# EAGLE schematic untitled (EAGLE 8.6.0)
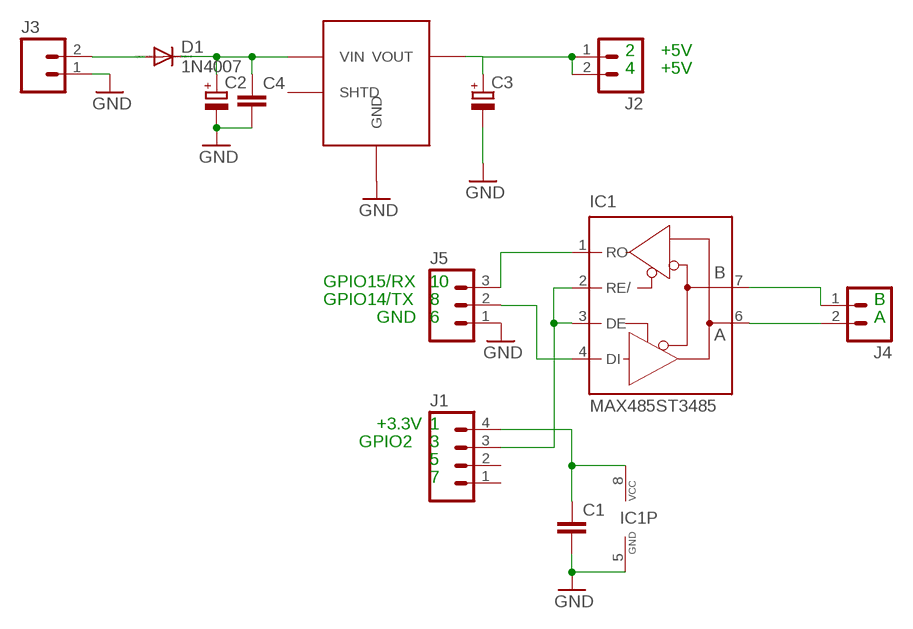
[diagram p0: schematic, sheet 1]

## Parts
C1  C-EU050-025X075  [C050-025X075]
C2  CPOL-EUSMD4X5.3  [UD-4X5,8_NICHICON]
C3  CPOL-EUSMD4X5.3  [UD-4X5,8_NICHICON]
C4  C-EU050-025X075  [C050-025X075]
D1  1N4007  [DO41-10]
IC1  MAX485ST3485  [SO08]
J1  M04  [1X04]
J2  M02  [1X02]
J3  M02-SCREW-3.5MM3.5MM  [SCREWTERMINAL-3.5MM-2]
J4  M02-SCREW-3.5MM3.5MM  [SCREWTERMINAL-3.5MM-2]
J5  M03  [1X03]
U$1  POLOLU-2098  [POLOLU-10-13]

## Nets
GND: C1.2 C2.- C3.- C4.2 IC1.5(GND) J3.1 J5.1 U$1.P$3(GND)
N$1: D1.A J3.2
N$2: C2.+ C4.1 D1.C U$1.P$2(VIN)
N$3: IC1.6(A) J4.2
N$4: C3.+ J2.1 J2.2 U$1.P$4(VOUT)
N$5: IC1.7(B) J4.1
N$6: IC1.4(DI) J5.2
N$7: IC1.1(RO) J5.3
N$8: C1.1 IC1.8(VCC) J1.4
N$10: IC1.2(RE/) IC1.3(DE) J1.3
Unconnected: J1.1 J1.2

## Notes on the sheet
- 2 | +5V
- 4 | +5V
- GPIO15/RX | 10
- GPIO14/TX | 8 | B
- GND | 6 | A
- +3.3V | 1
- GPIO2 | 3
- 5
- 7

## Power pins joined to a net without a drawn wire
SHTD: U$1.P$1(SHTD)

## Library data of the parts
C1 C4 = custom:C-EU: CAPACITOR, European symbol
C2 C3 = custom:CPOL-EU: POLARIZED CAPACITOR, European symbol
D1 = custom:1N4007: DIODE general purpose rectifier, 1 A
IC1 = custom:MAX485: RS485 TRANSEIVER
J1 = custom:M04
J2 = custom:M02
J3 J4 = custom:M02-SCREW-3.5MM: Standard 2-pin 0.1" header. Use with - straight break away headers ( PRT-00116) - right angle break away headers (PRT-00553) - swiss pins (PRT-00743) - machine pins (PRT-00117) - female headers (PRT-00115) Molex polarized connector foot print use with: PRT-08233 with associated crimp pins and housings. 2.54_SCREWTERM for use with PRT-10571. 3.5mm Screw Terminal footprints for PRT-08084 5mm Screw Terminal footprints for use with PRT-08432; PROD_ID: CONN-08399
J5 = custom:M03
U$1 = custom:POLOLU-2098: 5V Regulator - Max in 42V